# EAGLE schematic buck_12-3v3_mcc (EAGLE 9.6.2)
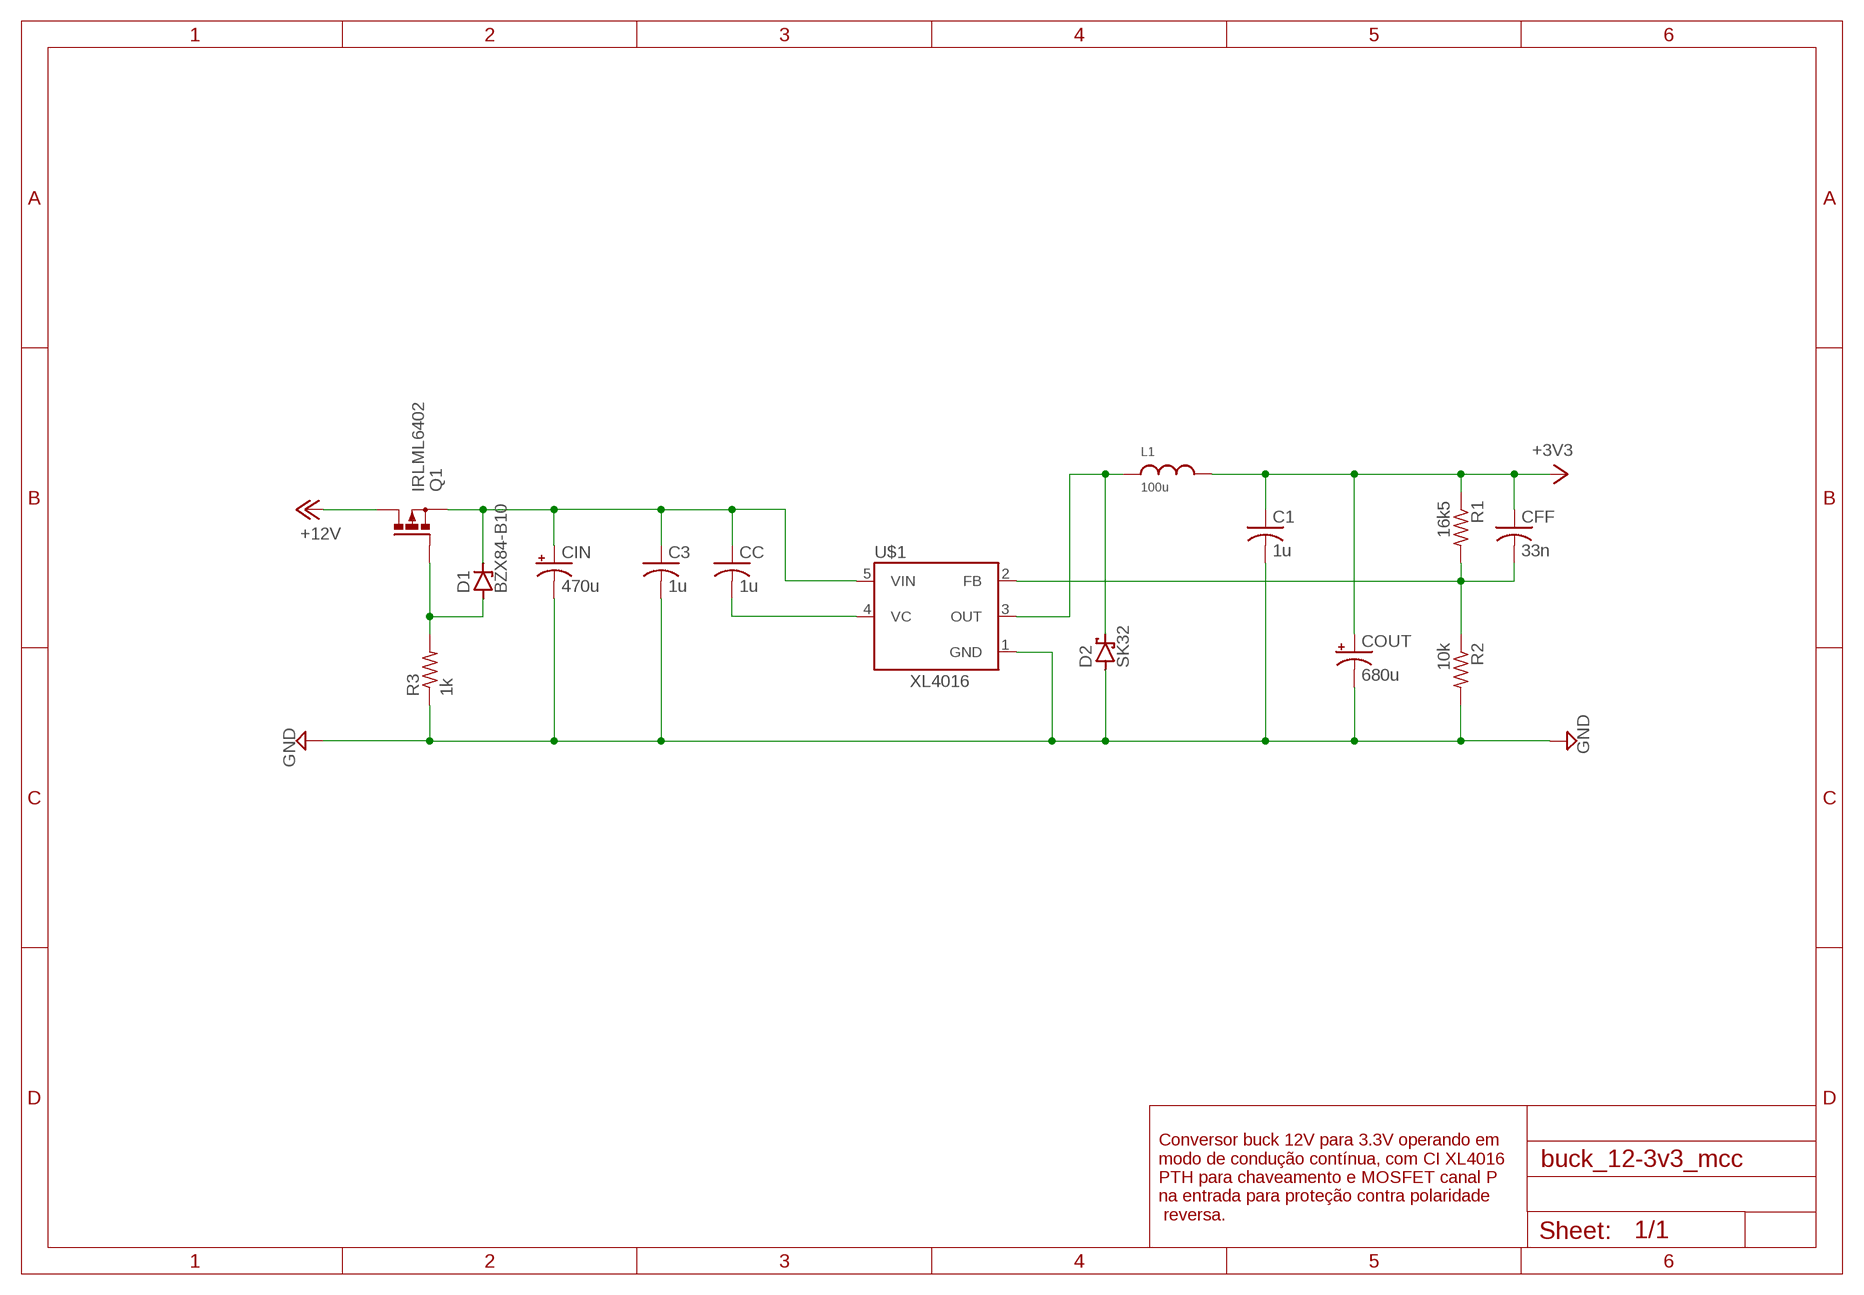
[diagram p0: schematic, sheet 1]

## Parts
C1  1u  C-USC1206  [C1206]
C3  1u  C-USC1206  [C1206]
CC  1u  C-USC1206  [C1206]
CFF  33n  C-USC1206  [C1206]
CIN  470u  CPOL-USE3.5-8  [E3,5-8]
COUT  680u  CPOL-USE3.5-8  [E3,5-8]
D1  BZX84-B10  ZENER-DIODESOT23  [SOT23]
D2  SK32  SCHOTTKY-DIODESMC  [SMC]
L1  100u  INDUCTOR_125125  [INDUTOR_125125]
Q1  IRLML6402  [SOT-23]
R1  16k5  R-US_R1206  [R1206]
R2  10k  R-US_R1206  [R1206]
R3  1k  R-US_M1206  [M1206]
U$1  XL4016  [LM2576T2]

## Nets
+3V2: C3.1 CC.1 CIN.+ D1.3(C) Q1.P2(S) U$1.5(VIN)
+3V3: C1.1 CFF.1 COUT.+ L1.P$2 R1.1
+12V: Q1.P3(D)
BYPASS: CC.2 U$1.4(VC)
FB: CFF.2 R1.2 R2.1 U$1.2(FB)
GND: C1.2 C3.2 CIN.- COUT.- D2.A R2.2 R3.1 U$1.1(GND)
N$5: D1.1(A) Q1.P1(G) R3.2
SWOUT: D2.C L1.P$1 U$1.3(OUT)

## Notes on the sheet
- Conversor buck 12V para 3.3V operando em
  modo de condução contínua, com CI XL4016
  PTH para chaveamento e MOSFET canal P
  na entrada para proteção contra polaridade
   reversa.

## Library data of the parts
C1 C3 CC CFF = adafruit:C-US: CAPACITOR, American symbol
CIN COUT = adafruit:CPOL-US: POLARIZED CAPACITOR, American symbol
D1 = diode:ZENER-DIODE: Z-Diode
D2 = diode:SCHOTTKY-DIODE: Schottky Diode
L1 = inductor:INDUCTOR_125125; INDUCTANCE: 100u
Q1 = mosfet:IRLML6402: Pch MOSFET IRLML6402 20V 3.7A http://akizukidenshi.com/catalog/g/gI-02553/ I-02553
R1-R3 = adafruit:R-US_: RESISTOR, American symbol
U$1 = XL4016:XL4016: Check availability <https://pricing.snapeda.com/parts/XL4016/XLSEMI/view-part?ref=eda>; AVAILABILITY: Not in stock; CHECK_PRICES: https://www.snapeda.com/parts/XL4016/XLSEMI/view-part/?ref=eda; DESCRIPTION: The XL4016 is a 180 KHz fixed frequency PWM buck (step-down) DC/DC converter, capable of driving a 8A load with high efficiency, low ripple and excellent line and load regulation.; MF: XLSEMI; MP: XL4016; PACKAGE: None; PRICE: None; SNAPEDA_LINK: https://www.snapeda.com/parts/XL4016/XLSEMI/view-part/?ref=snap